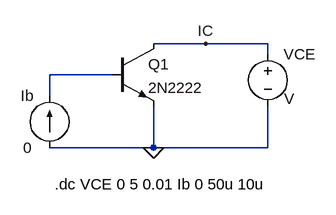
[diagram p0: schematic 1.1.1.asc]
1.1.1.asc, the LTspice schematic file:
Version 4
SHEET 1 880 680
WIRE 320 96 240 96
WIRE 416 96 320 96
WIRE 416 112 416 96
WIRE 176 144 80 144
WIRE 80 176 80 144
WIRE 240 256 240 192
WIRE 240 256 80 256
WIRE 416 256 416 192
WIRE 416 256 240 256
FLAG 240 256 0
FLAG 320 96 IC
SYMBOL npn 176 96 R0
SYMATTR InstName Q1
SYMATTR Value 2N2222
SYMBOL voltage 416 96 R0
WINDOW 3 25 85 Left 2
WINDOW 123 0 0 Left 0
WINDOW 39 0 0 Left 0
SYMATTR InstName VCE
SYMBOL current 80 256 R180
WINDOW 0 24 80 Left 2
WINDOW 3 27 0 Left 2
WINDOW 123 0 0 Left 0
WINDOW 39 0 0 Left 0
SYMATTR InstName Ib
SYMATTR Value 0
TEXT 88 312 Left 2 !.dc VCE 0 5 0.01 Ib 0 50u 10u

The netlist it stands for:
* 1.1.1.asc
Q1 IC N001 0 0 2N2222
VCE IC 0 V
Ib 0 N001 0
.model NPN NPN
.model PNP PNP
.lib standard.bjt
.dc VCE 0 5 0.01 Ib 0 50u 10u
.backanno
.end